# EAGLE design irs-qtouch (EAGLE 7.6.0)
CNAME: IRS sensor (RFM69HW); CREVISION: 1; DESIGNER: Dariusz Mazur

## Sheet 1 of 2
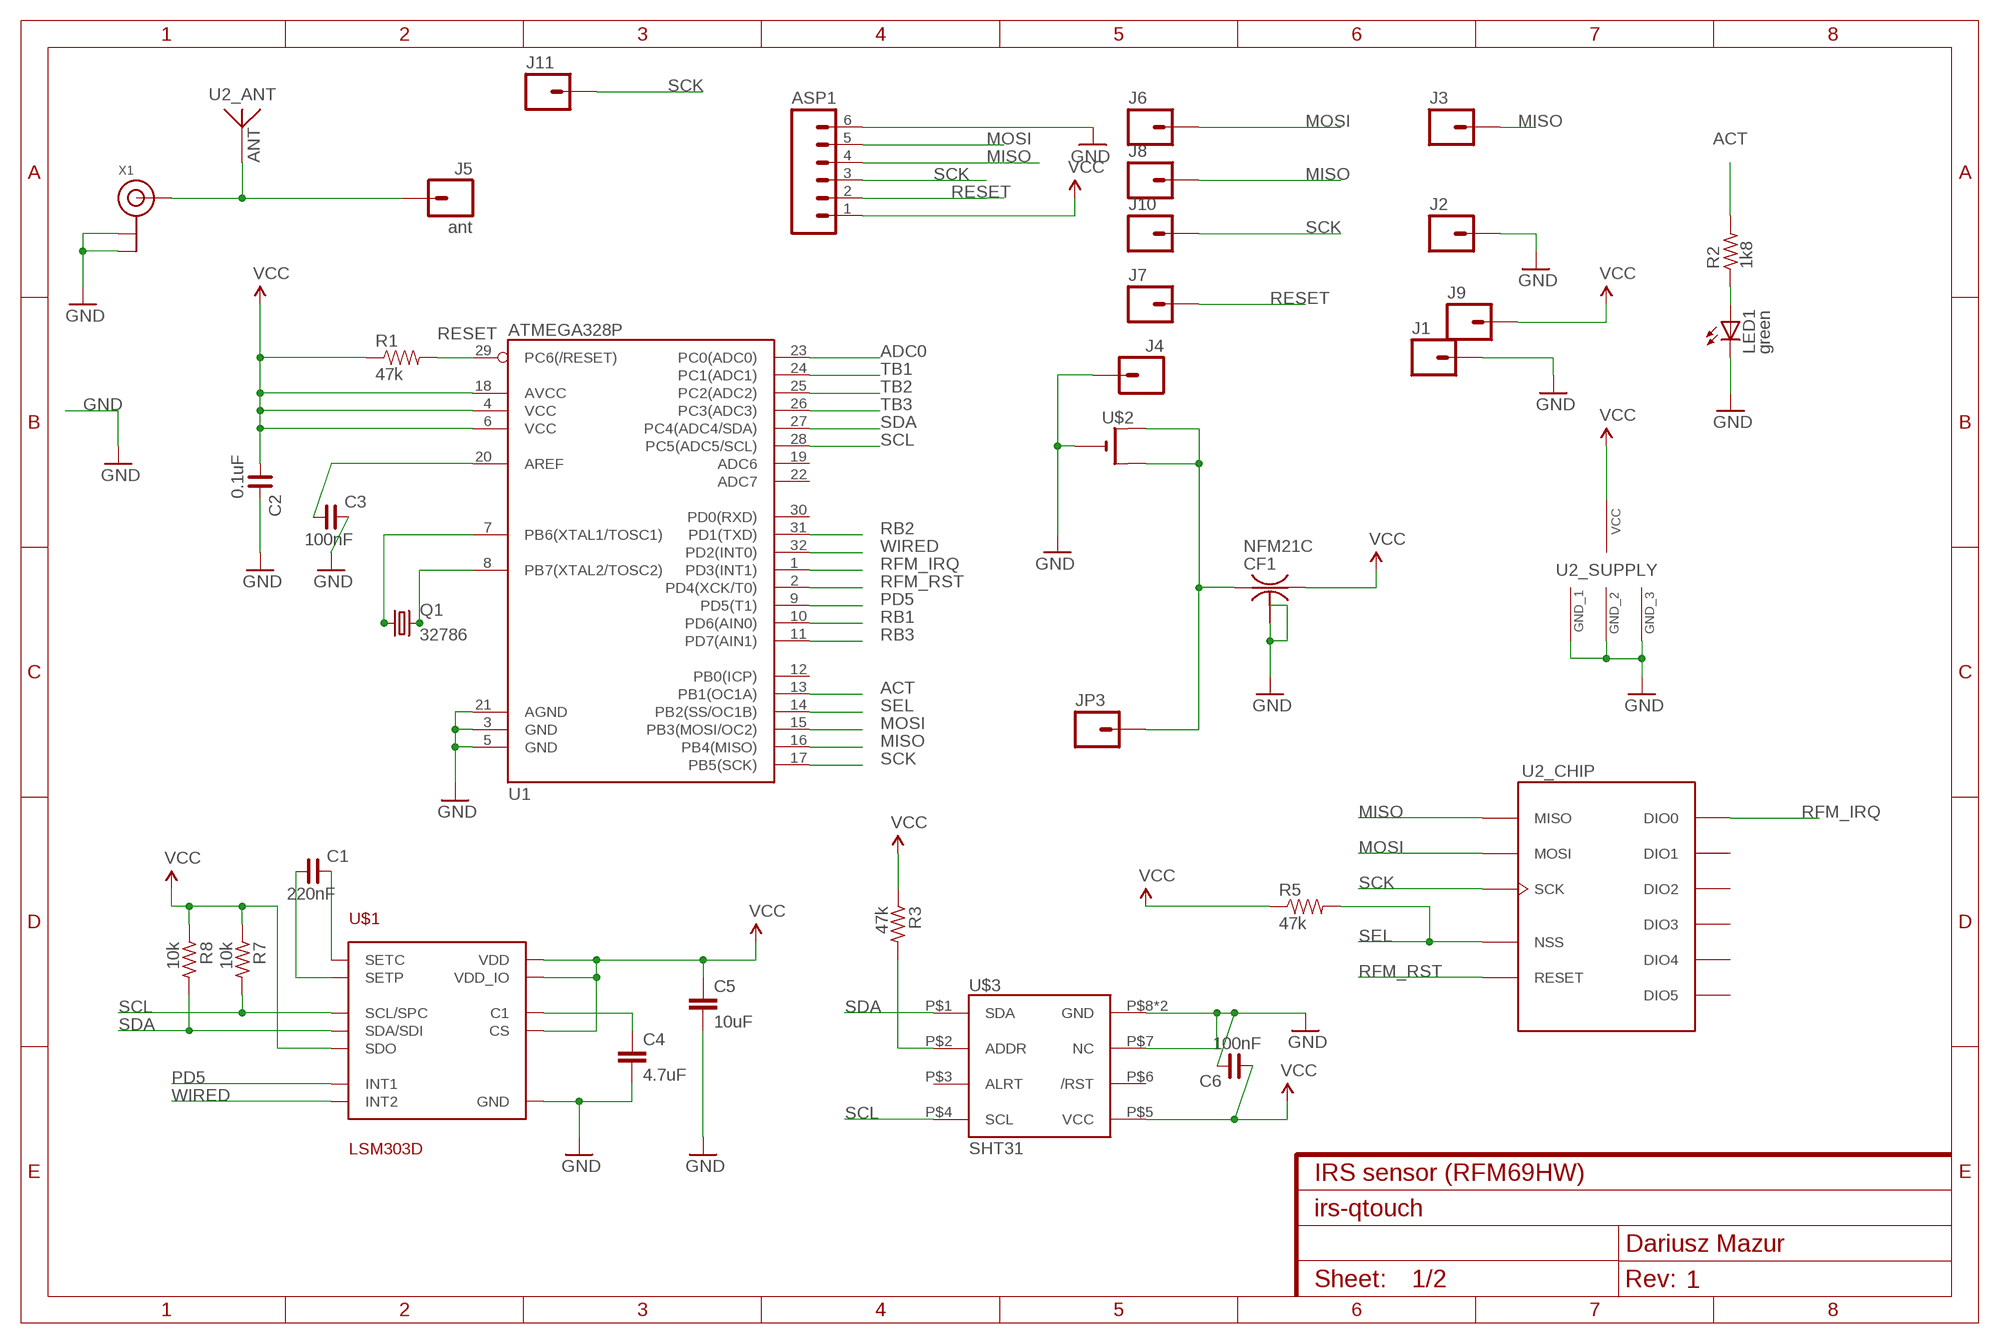
[diagram p0: schematic, sheet 1]

### Parts
ASP1  M06NO_SILK_YES_STOP  [1X06_NO_SILK_YES_STOP]
C1  220nF  C_0603  [C0603]
C2  0.1uF  C_0603  [C0603]
C3  100nF  C_0603  [C0603]
C4  4.7uF  C-EUC0603K  [C0603K]
C5  10uF  10UF10V10%(0805)  [0805-CAP]
C6  100nF  C_0603  [C0603]
CF1  NFM21C  [NFM21C]
J1  M01SMD-4.5X1.5  [PAD-1.5X4.5]
J2  M01PTH_NO_SILK_YES_STOP  [1X01_NO_SILK]
J3  M01PTH_NO_SILK_YES_STOP  [1X01_NO_SILK]
J4  M01SNAP-FEMALE  [SNAP-FEMALE]
J5  ant  M01PTH_NO_SILK_YES_STOP  [1X01_NO_SILK]
J6  M01SMD-4.5X1.5  [PAD-1.5X4.5]
J7  M01SMD-4.5X1.5  [PAD-1.5X4.5]
J8  M01SMD-4.5X1.5  [PAD-1.5X4.5]
J9  M01SMD-4.5X1.5  [PAD-1.5X4.5]
J10  M01SMD-4.5X1.5  [PAD-1.5X4.5]
J11  M01PTH_NO_SILK_YES_STOP  [1X01_NO_SILK]
JP3  M01SMDNS  [1X01NS]
LED1  green  LED0603  [LED-0603]
Q1  32786  MC-306  [MC-306]
R1  47k  RESISTOR0603-RES  [0603-RES]
R2  1k8  R_0603  [R0603]
R3  47k  R_0603  [R0603]
R5  47k  RESISTOR0603-RES  [0603-RES]
R7  10k  R_0603  [R0603]
R8  10k  R_0603  [R0603]
U1  ATMEGA328P  ATMEGA328_SMT  [TQFP32-08]
U2  RFM69HCW-S2  [HOPE-RF-16]
U$1  LSM303D  [LGA16-3MM]
U$2  CR2032THM  [CR2032-THRU]
U$3  SHT31  SHT31-DIS  [SHT3X]
X1  ANTENNA_U.FL  [U.FL]

### Nets
ACT: R2.2 U1.13(PB1(OC1A))
ADC0: U1.23(PC0(ADC0))
GND: ASP1.6 C2.2 C3.2 C4.2 C5.2 C6.2 CF1.2@1 CF1.2@2 J1.P$1 J2.1 J4.1 LED1.C U1.3(GND) U1.5(GND) U1.21(AGND) U2.GND1(_SUPPLY:GND_1) U2.GND2(_SUPPLY:GND_2) U2.GND3(_SUPPLY:GND_3) U$1.5(GND) U$1.10(GND) U$1.12(GND) U$1.13(GND) U$1.16(GND) U$2.- U$3.P$7(NC) U$3.P$8(GND) U$3.PAD(GND) X1.1(GND) X1.2(GND)
MISO: ASP1.4 J3.1 J8.P$1 U1.16(PB4(MISO)) U2.MISO(_CHIP:MISO)
MOSI: ASP1.5 J6.P$1 U1.15(PB3(MOSI/OC2)) U2.MOSI(_CHIP:MOSI)
N$1: LED1.A R2.1
N$2: CF1.1 JP3.1 U$2.+1(+) U$2.+2(+1)
N$3: J5.1 U2.ANT(_ANT:ANT) X1.3(SIGNAL)
N$4: C3.1 U1.20(AREF)
N$5: Q1.1 U1.7(PB6(XTAL1/TOSC1))
N$6: Q1.4 U1.8(PB7(XTAL2/TOSC2))
N$12: C1.1 U$1.3(SETP)
N$13: C1.2 U$1.2(SETC)
N$14: C4.1 U$1.15(C1)
N$15: R3.2 U$3.P$2(ADDR)
PD5: U1.9(PD5(T1)) U$1.11(INT1)
RB1: U1.10(PD6(AIN0)) ; also sheet 2
RB2: U1.31(PD1(TXD)) ; also sheet 2
RB3: U1.11(PD7(AIN1)) ; also sheet 2
RESET: ASP1.2 J7.P$1 R1.2 U1.29(PC6(/RESET))
RFM_IRQ: U1.1(PD3(INT1)) U2.DIO0(_CHIP:DIO0)
RFM_RST: U1.2(PD4(XCK/T0)) U2.RESET(_CHIP:RESET)
SCK: ASP1.3 J10.P$1 J11.1 U1.17(PB5(SCK)) U2.SCK(_CHIP:SCK)
SCL: R7.2 U1.28(PC5(ADC5/SCL)) U$1.4(SCL/SPC) U$3.P$4(SCL)
SDA: R8.2 U1.27(PC4(ADC4/SDA)) U$1.6(SDA/SDI) U$3.P$1(SDA)
SEL: R5.2 U1.14(PB2(SS/OC1B)) U2.NSS(_CHIP:NSS)
TB1: U1.24(PC1(ADC1)) ; also sheet 2
TB2: U1.25(PC2(ADC2)) ; also sheet 2
TB3: U1.26(PC3(ADC3)) ; also sheet 2
VCC: ASP1.1 C2.1 C5.1 C6.1 CF1.3 J9.P$1 R1.1 R3.1 R5.1 R7.1 R8.1 U1.4(VCC) U1.6(VCC) U1.18(AVCC) U2.3.3V(_SUPPLY:VCC) U$1.1(VDD_IO) U$1.7(SDO) U$1.8(CS) U$1.14(VDD) U$3.P$5(VCC)
WIRED: U1.32(PD2(INT0)) U$1.9(INT2)
Unconnected: U1.12(PB0(ICP)) U1.19(ADC6) U1.22(ADC7) U1.30(PD0(RXD)) U2.DIO1(_CHIP:DIO1) U2.DIO2(_CHIP:DIO2) U2.DIO3(_CHIP:DIO3) U2.DIO4(_CHIP:DIO4) U2.DIO5(_CHIP:DIO5) U$3.P$3(ALRT) U$3.P$6(/RST)

## Sheet 2 of 2
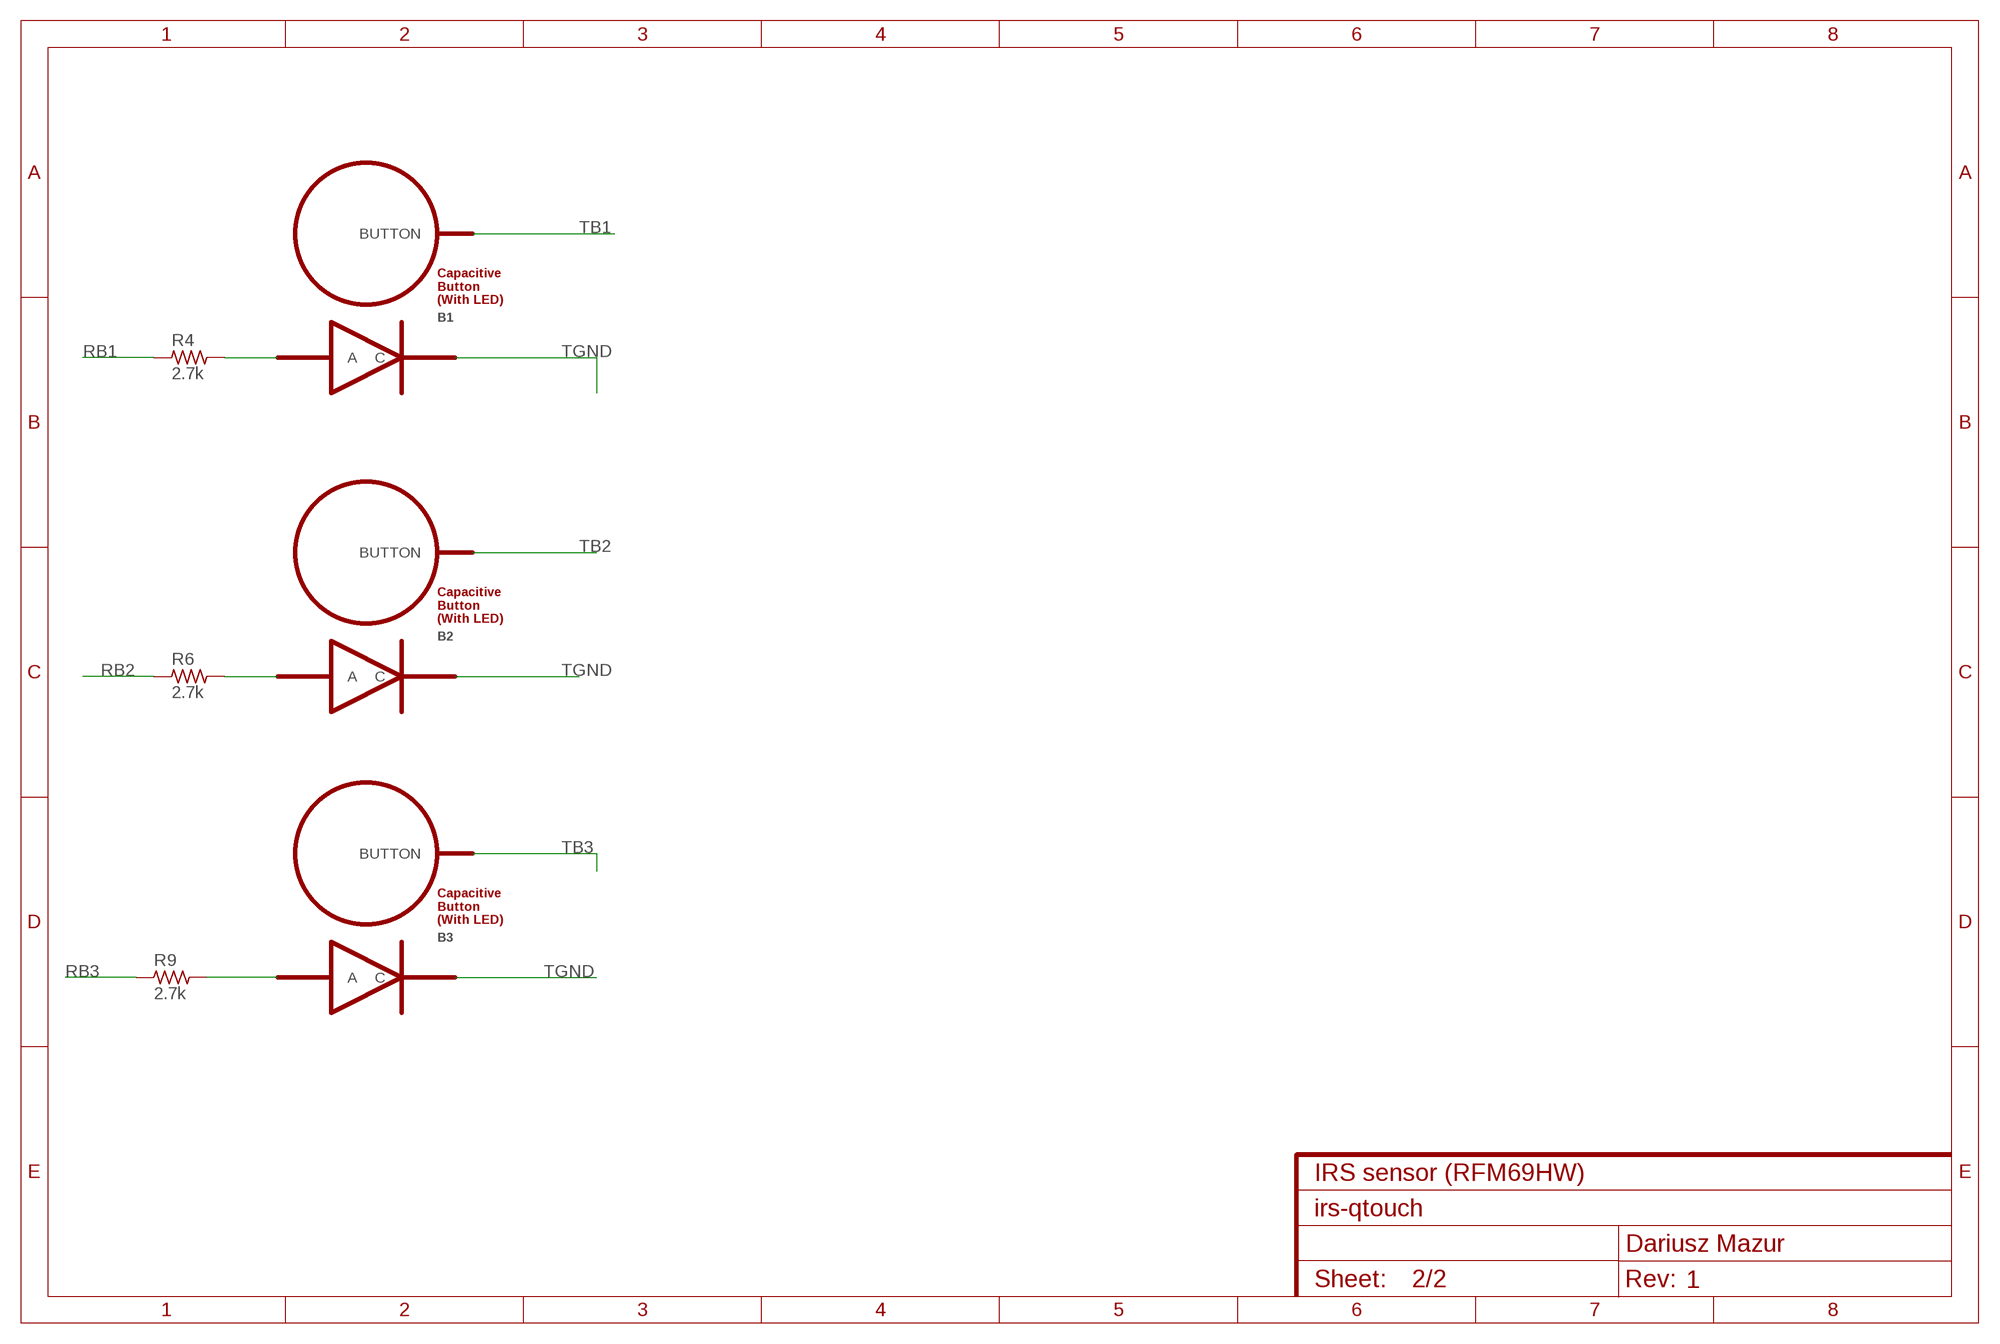
[diagram p1: schematic, sheet 2]

### Parts
B1  BUTTON_PASSIVE_LED  [BUTTON_PASSIVE_12MM_LED]
B2  BUTTON_PASSIVE_LED  [BUTTON_PASSIVE_12MM_LED]
B3  BUTTON_PASSIVE_LED  [BUTTON_PASSIVE_12MM_LED]
R4  2.7k  R_0603  [R0603]
R6  2.7k  R_0603  [R0603]
R9  2.7k  R_0603  [R0603]

### Nets
N$11: B2.A R6.2
N$19: B1.A R4.2
N$20: B3.A R9.2
RB1: R4.1 ; also sheet 1
RB2: R6.1 ; also sheet 1
RB3: R9.1 ; also sheet 1
TB1: B1.BUTTON ; also sheet 1
TB2: B2.BUTTON ; also sheet 1
TB3: B3.BUTTON ; also sheet 1
TGND: B1.C B3.C
Unconnected: B2.C

## Library data of the parts
ASP1 = SparkFun-Connectors:M06: Header 6 Standard 6-pin 0.1" header. Use with straight break away headers (SKU : PRT-00116), right angle break away headers (PRT-00553), swiss pins (PRT-00743), machine pins (PRT-00117), and female headers (PRT-00115). Molex polarized connector foot print use with SKU : PRT-08094 with associated crimp pins and housings. NOTES ON THE VARIANTS LOCK and LOCK_LONGPADS... This footprint was designed to help hold the alignment of a through-hole component (i.e. 6-pin header) while soldering it into place. You may notice that each hole has been shifted either up or down by 0.005 of an inch from it's more standard position (which is a perfectly straight line). This slight alteration caused the pins (the squares in the middle) to touch the edges of the holes. Because they are alternating, it causes a "brace" to hold the component in place. 0.005 has proven to be the perfect amount of "off-center" position when using our standard breakaway headers. Although looks a little odd when you look at the bare footprint, once you have a header in there, the alteration is very hard to notice. Also,if you push a header all the way into place, it is covered up entirely on the bottom side. This idea of altering the position of holes to aid alignment will be further integrated into the Sparkfun Library for other footprints. It can help hold any component with 3 or more connection pins.
B1-B3 = PatternAgents-TouchWidgets:BUTTON_PASSIVE_LED: Button, Passive Touch/Capacitive Sensing Type, with LED & Hole Source : http://www.PatternAgents.com Github : https://github.com/PatternAgents License : http://creativecommons.org/licenses/by-sa/3.1/ (Creative Commons 3.1) THIS SOFTWARE IS PROVIDED BY THE CONTRIBUTORS "AS IS" AND WITHOUT ANY EXPRESS OR IMPLIED WARRANTIES, INCLUDING, BUT NOT LIMITED TO, THE IMPLIED WARRANTIES OF MERCHANTABILITY AND FITNESS FOR A PARTICULAR PURPOSE ARE DISCLAIMED. IN NO EVENT SHALL THE COPYRIGHT OWNER OR CONTRIBUTORS BE LIABLE FOR ANY DIRECT, INDIRECT, INCIDENTAL, SPECIAL, EXEMPLARY, OR CONSEQUENTIAL DAMAGES (INCLUDING, BUT NOT LIMITED TO, PROCUREMENT OF SUBSTITUTE GOODS OR SERVICES; LOSS OF USE, DATA, OR PROFITS; OR BUSINESS INTERRUPTION) HOWEVER CAUSED AND ON ANY THEORY OF LIABILITY, WHETHER IN CONTRACT, STRICT LIABILITY, OR TORT (INCLUDING NEGLIGENCE OR OTHERWISE) ARISING IN ANY WAY OUT OF THE USE OF THIS SOFTWARE, EVEN IF ADVISED OF THE POSSIBILITY OF SUCH DAMAGE.
C1-C3 C6 = rc-master-smd:C_: NON-POLARIZED CAP
C4 = resistor:C-EU: CAPACITOR, European symbol
C5 = SparkFun-Capacitors:10UF10V10%(0805): CAP-11330; PROD_ID: CAP-11330
CF1 = murata-filter:NFM: EMIFIL(R) (Capacitor type) Single Circuit Type for Signal Lines Source: http://search.murata.co.jp/Ceramy/image/img/PDF/ENG/L0111S0109NFM3DC.pdf; MPN: NFM21CC102R1H3D; OC_FARNELL: 1828795; OC_NEWARK: 84R0165
J1-J11 JP3 = SparkFun-Connectors:M01: Header 1 Standard 1-pin 0.1" header. Use with straight break away headers (SKU : PRT-00116), right angle break away headers (PRT-00553), swiss pins (PRT-00743), machine pins (PRT-00117), and female headers (PRT-00115). SMTSO-256-ET is a "flush mount" nut for a 4-40 screw. The older package used to be too tight, and did not allow it to sit properly thru the drill hit. The latest (0.165DIA) fits nice and snug.
LED1 = SparkFun-LED:LED: LEDs Standard schematic elements and footprints for 5mm, 3mm, 1206, and 0603 sized LEDs. 5mm - Spark Fun Electronics SKU : COM-00529 (and others)
Q1 = crystal:MC-306: kHz RANGE CRYSTAL UNIT SMD Source: MC-306_405_406_E07X.PDF Homepage <http://www.epsontoyocom.co.jp>; MPN: MC-306 60.0KHZ 100PPM ,12.5PF; OC_FARNELL: 1278040; OC_NEWARK: 31M5576
R1 R5 = SparkFun-Passives:RESISTOR: Resistor Basic schematic elements and footprints for 0603, 1206, and PTH resistors.
R2-R4 R6-R9 = rc-master-smd:R_: RESISTOR
U1 = SparkFun-DigitalIC:ATMEGA328_SMT: 32-Pin Atmega328 part Commonly used on Arduino compatible boards Available in QFP and QFN packages TQFP is IC-09069 QFN is non-stock; PROD_ID: IC-09069
U2 = icmi-custom-parts:RFM69HCW: HopeRF RFM69HCW ISM Transceiver Module The RFM69HCW <http://www.hoperf.com/rf/fsk_module/RFM69HCW.htm> is a transceiver module capable of operation over a wide frequency range, including the 315,433,868 and 915MHz license-free ISM (Industry Scientific and Medical) frequency bands. All major RF communication parameters are programmable and most of them can be dynamically set. The RFM69HCW offers the unique advantage of programmable narrow-band and wide- band communication modes. The RFM69HCW is optimized for low power consumption while offering high RF output power and channelized operation. Compliance ETSI and FCC regulations. In order to better use RFM69HCW modules, this specification also involves a large number of the parameters and functions of its core chip RF69H's,including those IC pins which are not leaded out. All of these can help customers gain a better understanding of the performance of RFM69HCW modules, and enhance the application skills.
U$1 = pimoroni-ics:LSM303D
U$2 = adafruit:CR2032
U$3 = thomasb9511:SHT31-DIS
X1 = adafruit:ANTENNA_U.FL: U.FL Antenna Connector

## Board
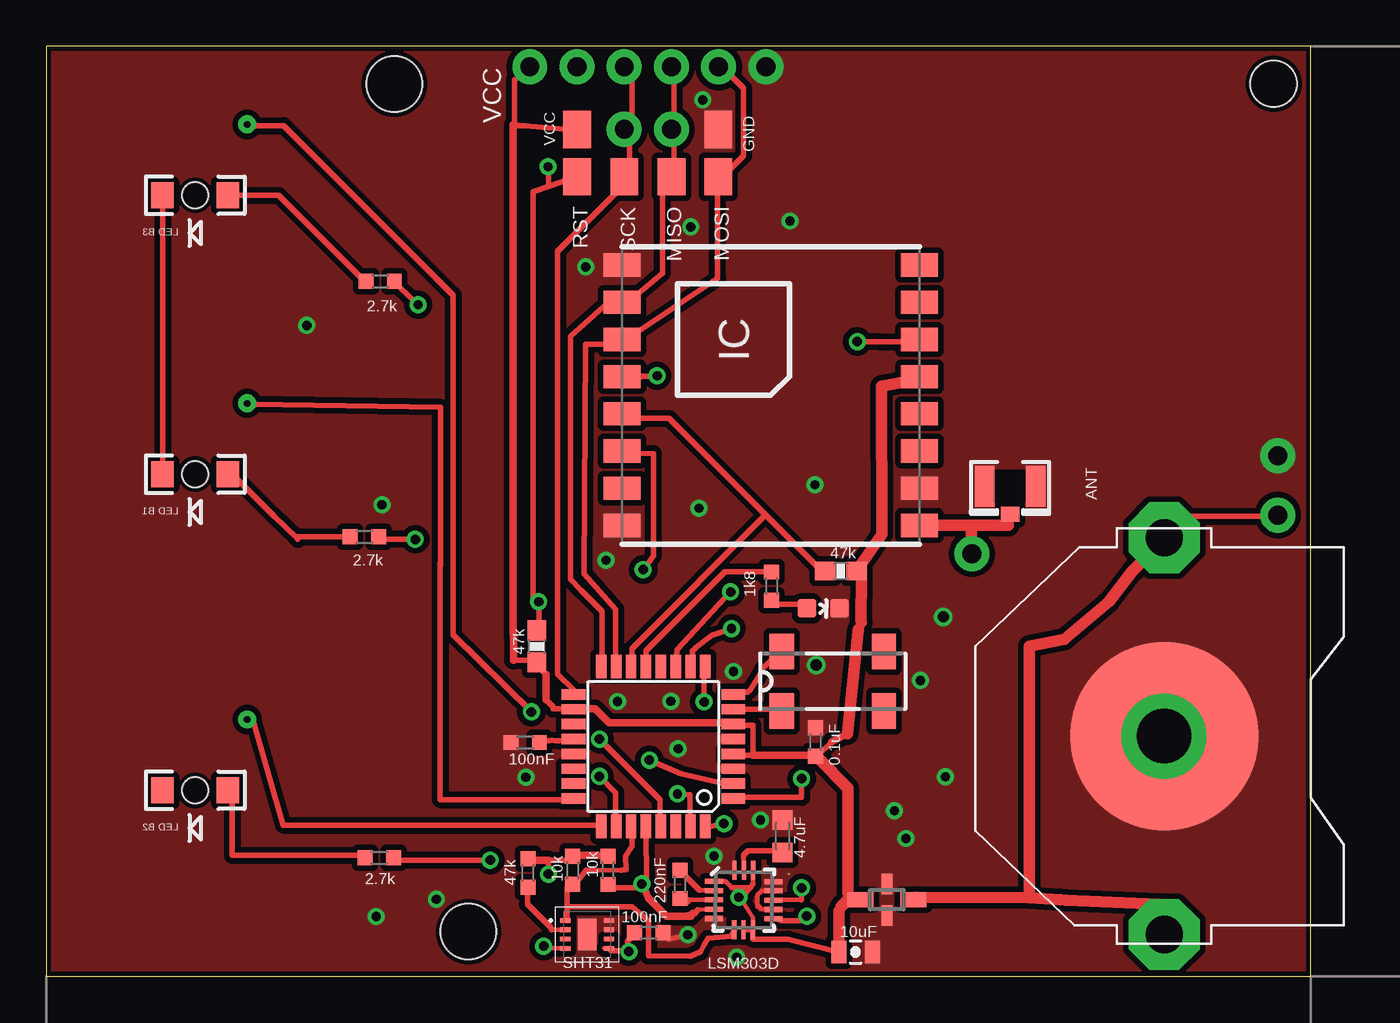
[diagram p2: board, top side]
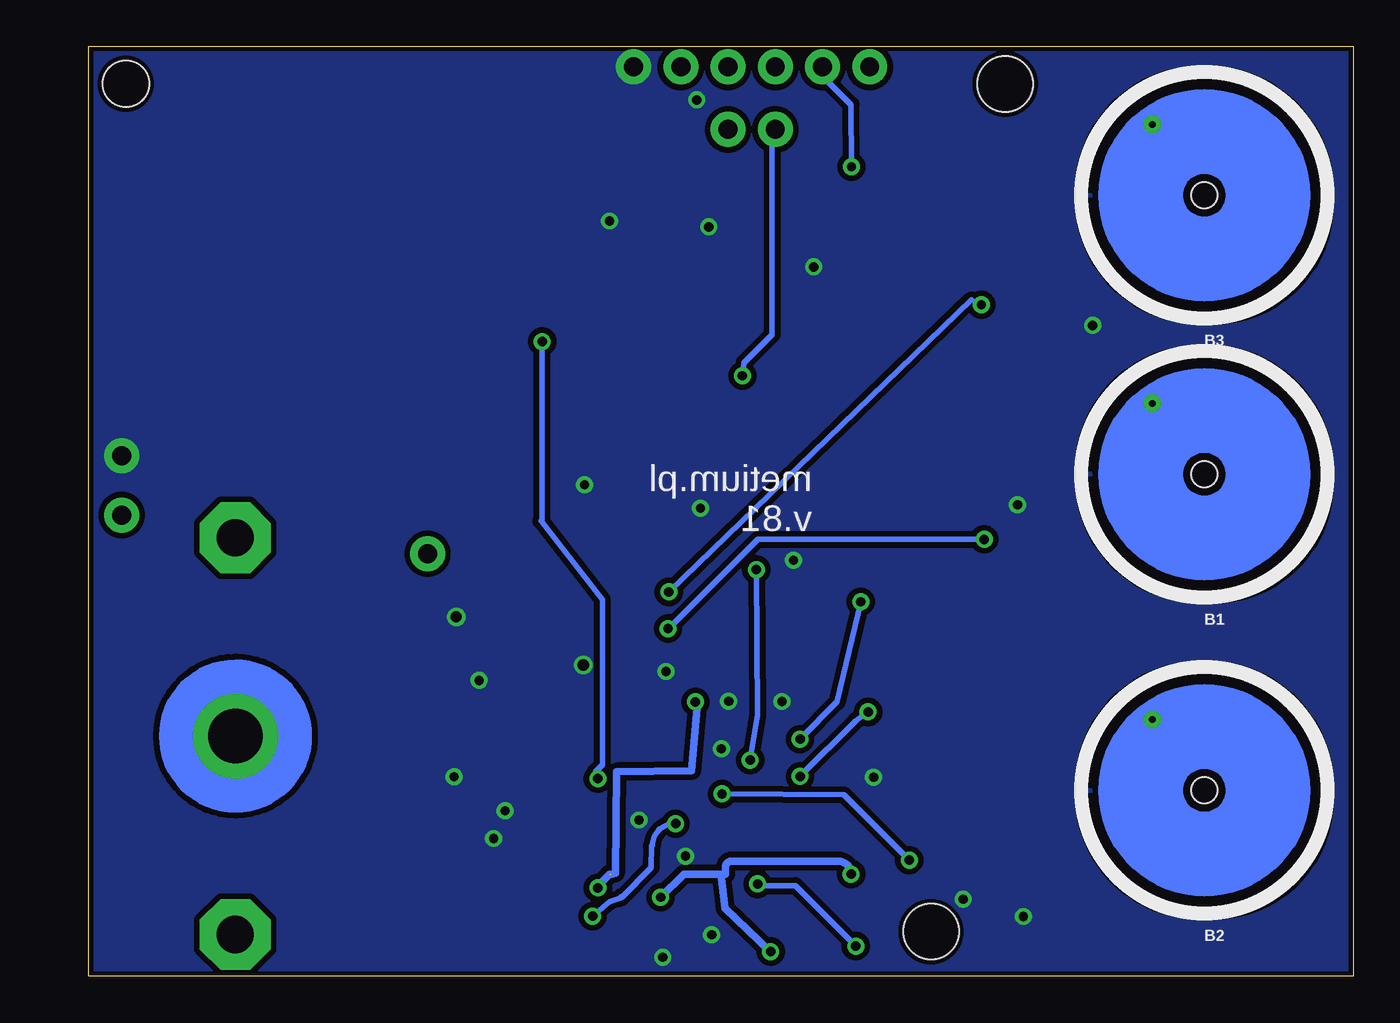
[diagram p3: board, bottom side, seen from below]

Size 68 x 50 mm. Coordinates in mm from the lower left corner, seen from the top.
Outline: 0,0 68,0 68,50 0,50 0,0
Copper layers (1*16): Top 0.035mm / dielectric 1.5mm / Bottom 0.035mm
Design rules "dirt_cheap_dirty_boards.v1 *": minimum track width 12mil, minimum drill 20mil, track to track 12mil, track to pad 10mil, pad to pad 10mil, via to via 12mil, smd to smd 0mil, copper to edge 10mil, drill to drill 12mil, minimum pad ring 12mil, minimum via ring 8mil, stop-mask expansion 2mil, vias tented up to drill 25mil, thermal gap 10mil
Holes 2.5 mm at 66.01,47.99
Holes 3 mm at 22.7,2.4 18.71,47.98

### Footprints (pad centres in the part's own frame; a part is rotated, then mirrored left to right if it is on the bottom)
1X06_NO_SILK_YES_STOP = drill 1.016 pad 1.88: 1 0,0; 2 2.54,0; 3 5.08,0; 4 7.62,0; 5 10.16,0; 6 12.7,0
BUTTON_PASSIVE_12MM_LED = smd 1.2 x 1.4 bottom: A -1.754,0; C 1.754,0 | drill 0.356: BUTTON -2.794,3.81 | hole 1.4: 0,0
C0603 = smd 0.8 x 0.8: 1 -0.762,0; 2 0.762,0
C0603K = smd 1.05 x 1.08: 1 -0.875,0; 2 0.875,0
0805-CAP = smd 0.8 x 1.2: 1 -0.9,0; 2 0.9,0
NFM21C = smd 1.4 x 0.8: 1 -1.425,0; 3 1.425,0 | smd 0.6 x 1.1: 2@1 0,-0.85; 2@2 0,0.85
PAD-1.5X4.5 = smd 1.5 x 2: P$1 0,0
1X01_NO_SILK = drill 1.016 pad 1.88: 1 0,0
SNAP-FEMALE = drill 2.921 pad 4.572: 1 0,0
1X01NS = drill 1.016 pad 1.88: 1 0,0
LED-0603 = smd 1 x 1: A 0,-0.877; C 0,0.877
MC-306 = smd 1.3 x 1.9: 1 -2.75,-1.6; 2 2.75,-1.6; 3 2.75,1.6; 4 -2.75,1.6
0603-RES = smd 1.1 x 1: 1 -0.85,0; 2 0.85,0
R0603 = smd 0.8 x 0.8: 1 -0.762,0; 2 0.762,0
TQFP32-08 = smd 1.27 x 0.559: 1 -4.293,2.8; 2 -4.293,2; 3 -4.293,1.2; 4 -4.293,0.4; 5 -4.293,-0.4; 6 -4.293,-1.2; 7 -4.293,-2; 8 -4.293,-2.8; 17 4.293,-2.8; 18 4.293,-2; 19 4.293,-1.2; 20 4.293,-0.4; 21 4.293,0.4; 22 4.293,1.2; 23 4.293,2; 24 4.293,2.8 | smd 0.559 x 1.27: 9 -2.8,-4.293; 10 -2,-4.293; 11 -1.2,-4.293; 12 -0.4,-4.293; 13 0.4,-4.293; 14 1.2,-4.293; 15 2,-4.293; 16 2.8,-4.293; 25 2.8,4.293; 26 2,4.293; 27 1.2,4.293; 28 0.4,4.293; 29 -0.4,4.293; 30 -1.2,4.293; 31 -2,4.293; 32 -2.8,4.293
HOPE-RF-16 = smd 1.25 x 2: 3.3V 1,-8; ANT -7,-8; DIO0 3,-8; DIO1 5,-8; DIO2 7,-8; DIO3 -3,-8; DIO4 -1,-8; DIO5 -5,8; GND1 7,8; GND2 -7,8; GND3 -5,-8; MISO 5,8; MOSI 3,8; NSS -1,8; RESET -3,8; SCK 1,8
LGA16-3MM = smd 1 x 0.25: 1 -1.6,1; 2 -1.6,0.5; 3 -1.6,0; 4 -1.6,-0.5; 5 -1.6,-1; 9 1.6,-1; 10 1.6,-0.5; 11 1.6,0; 12 1.6,0.5; 13 1.6,1 | smd 0.25 x 1: 6 -0.5,-1.6; 7 0,-1.6; 8 0.5,-1.6; 14 0.5,1.6; 15 0,1.6; 16 -0.5,1.6
CR2032-THRU = drill 2 pad 3.81 octagon: +1 -10.668,0; +2 10.668,0 | smd 10.16 x 10.16: - 0,0
SHT3X = smd 0.55 x 0.25: P$1 -1.175,0.75; P$2 -1.175,0.25; P$3 -1.175,-0.25; P$4 -1.175,-0.75; P$5 1.175,-0.75; P$6 1.175,-0.25; P$7 1.175,0.25; P$8 1.175,0.75 | smd 1 x 1.7: PAD 0,0
U.FL = smd 2.2 x 1.05: 1 0,1.375; 2 0,-1.375 | smd 0.8 x 1: 3 1.525,0

### Placement (x,y rotation side)
ASP1  26,48.9 180 bottom
B1  8,27 0 bottom
B2  8,10 0 bottom
B3  8,42 0 bottom
C1  34.08,4.94 90 top
C2  41.37,12.6 90 top
C3  25.75,12.57 180 top
C4  39.6,7.54 90 top
C5  43.53,1.3 0 top
C6  32.4,2.34 0 top
CF1  45.21,4.12 180 top
J1  36.14,45.54 0 top
J2  66.24,28 90 top
J3  33.62,45.54 0 top
J4  60.12,12.92 0 bottom
J5  49.78,22.72 0 top
J6  36.14,43 180 top
J7  28.54,43 180 top
J8  33.62,43 180 top
J9  28.54,45.54 0 top
J10  31.08,43 180 top
J11  31.08,45.54 0 top
JP3  66.24,24.8 90 top
LED1  41.78,19.78 270 top
Q1  42.3,15.87 0 top
R1  26.39,17.74 90 top
R2  39.01,20.98 90 top
R3  25.9,5.55 270 top
R4  17.1,23.63 180 top
R5  42.74,21.79 180 top
R6  17.9,6.37 180 top
R7  30.21,5.7 270 top
R8  28.31,5.7 270 top
R9  17.95,37.37 180 top
U1  32.65,12.36 180 top
U2  38.96,31.24 90 top
U$1  37.51,4.1 359.7 top
U$2  60.13,12.91 270 top
U$3  29.09,2.25 0 top
X1  51.84,26.36 270 top

### Tracks (layer width: path | path; a pad name or v marks a point on that pad's centre or on a via)
ACT
  Top 0.305: R2.2 36.5,21.75 32.25,17.5 32.25,16.75 U1.13
ADC0
  Top 0.305: 28.2,10.37 U1.23
GND  (via drill 0.5, 0.5 pad 0.25, 0.51, 0.6 pad 0.25)
  Top 0.254: U$1.12 38.47,4.59 38.47,4.58 38.45,4.58 38.25,4.37 38.25,3.84 | 38.25,3.84 38.49,3.59 U$1.10 39,3.62 | 38.25,3.75 38.25,3.84
  Top 0.305: U1.21 | 33.5,2 v34.5,2.23
  other vias: 17.74,3.22 20.97,4.14 47.02,15.91 48.24,19.33 33.59,14.79 30.71,14.78 48.36,10.73 46.24,7.41 35.91,6.46 41.34,26.43 37.13,1.03 36.95,16.39 38.41,8.4 45.62,8.9 14,35 18.05,25.36 41.4,16.74 25.79,10.7 33.98,12.24 35.3,47.13 29.01,38.15 35.1,25.16 30.1,22.37 34.66,40.3 40,40.61
  pour Bottom (no thermals): 0,50 68,50 68,0 0.1,0
  pour Top (no thermals): 0,0 68,0 68,50 0,50
MISO
  Top 0.305: 29.88,16.75 U1.16 29.88,16.88 29.88,19.62 28.75,20.75 28.18,21.36 28.19,34.42 30.5,36.5 U2.MISO | 34,43 33.75,43 | 30.62,36.12 30.88,36.12 U2.MISO | 33.75,43 33.75,45.5 J3.1 33.75,45.75 33.75,48.75 ASP1.4 | 33.75,43 J8.P$1 33.5,43 33.13,42.31 33.13,37.81 31,36 U2.MISO
MOSI
  Top 0.305: ASP1.5 36.5,48.75 37.5,47.75 37.5,44.12 36.38,43 J6.P$1 36.12,42.88 36.1,41.29 36.1,37.54 31.38,34.38 31,34.38 U2.MOSI | 30.62,34.12 30.88,34.12 U2.MOSI | U1.15 30.62,16.75 30.62,19.75 28.92,21.65 28.99,34 30.5,34 U2.MOSI | 30.5,34.12 U2.MOSI
N$1
  Top 0.305: R2.1 39.25,20 40.75,20 LED1.A
N$2
  Top 0.254: 60,4 60,2.5 U$2.+2 | 60,23.5 U$2.+1
  Top 0.305: 46.75,4.25 CF1.1 | 59.88,3.88 U$2.+2 | 54.83,4.08 54.53,4.11 | 60,23.38 U$2.+1 60.25,23.62 60.25,24.75 66.12,24.75 JP3.1
  Top 0.61: 54.53,4.11 52.87,4.24 | 52.87,4.24 52.87,17.75 54.75,18.12 57.14,20.15 58.38,21.75 60,23.38 | 52.87,4.24 46.75,4.25 | 54.83,4.08 59.88,3.88
N$3
  Top 0.305: 47,24.25 U2.ANT 47.12,24.25 | 49.75,22.75 J5.1 | 51.75,24.25 51.75,24.75 X1.3
  Top 0.61: 49.75,24.25 47.12,24.25 | 49.75,22.75 49.75,24.25 | 51.75,24.25 49.75,24.25
N$4
  Top 0.305: U1.20 27.56,12.65 arc27 C3.1
N$5
  Top 0.305: U1.7 39.29,14.36 Q1.1
N$6
  Top 0.305: U1.8 36.95,15.27 37.7,15.27 37.86,15.4 38.49,16.41 38.5,16.5 39.5,17.5 Q1.4
N$11
  Top 0.305: 17.12,6.38 17,6.38 17,6.5 R6.2 16.88,6.5 10,6.5 10,9.88 B2.A 10,10
N$12
  Top 0.254: 34.5,4.12 35.88,4.12 U$1.3
  Top 0.305: C1.1 34,4 34.5,4 34.5,4.12
N$13
  Top 0.254: 35.12,4.62 35.88,4.62 U$1.2
  Top 0.305: 35.12,4.62 34.12,5.62 34.12,5.75 C1.2
N$14
  Top 0.254: 37.5,6.38 37.5,5.75 U$1.15
  Top 0.305: 37.5,6.38 37.5,6.5 37.75,6.75 38.5,6.75 38.55,6.74 39.55,6.74 C4.1
N$15
  Top 0.254: 27.18,2.5 U$3.P$2
  Top 0.305: 26,4.88 R3.2 25.88,4.75 25.88,3.88 27.12,2.62 27.18,2.5
N$19
  Top 0.305: 13.45,23.57 12.25,24.75 10,27 B1.A | 13.45,23.57 13.52,23.5 | R4.2 16.25,23.62 13.5,23.62 13.45,23.57
N$20
  Top 0.305: 10,42 B3.A 12.5,42 17.12,37.38 R9.2
PD5  (via drill 0.51)  (1 unrouted)
  Top 0.254: 40.62,4.12 39.12,4.12 U$1.11
  Top 0.305: v40.62,4.75 40.62,4.12 | 35.25,14.71 v35.38,14.75 35.38,16.5 U1.9 35.5,16.62
  Bottom 0.254: 40.75,4.88 40.62,4.88 v40.62,4.75
  Bottom 0.305: v35.38,14.75 35.25,14.71
  Bottom 0.406: 35.25,14.71 35.58,11.06 39.62,11 39.68,5.54 39.88,5.5 | 40,5.5 40.62,4.88
RB1  (via drill 0.51)
  Top 0.305: v36.85,18.7 35.8,18.33 34.91,17.67 34.88,17.62 34.75,17.5 34.75,16.75 U1.10 | 17.88,23.62 R4.1 18,23.5 v19.84,23.5
  Bottom 0.305: v19.84,23.5 32,23.5 36.5,19 v36.85,18.7
RB2  (via drill 0.51)
  Top 0.305: v33.95,9.8 34.62,9.75 34.62,8.25 | 34.62,8.12 34.62,8.25 | R6.1 18.75,6.25 23.75,6.25 v23.87,6.24 | U1.31 34.75,8.25 34.62,8.25
  Bottom 0.305: v23.87,6.24 27.38,9.75 v33.95,9.8
RB3  (via drill 0.51)
  Top 0.305: v36.8,20.67 33.93,17.57 33.88,16.75 U1.11 | v19.99,36.11 18.5,37.5 18.62,37.38 R9.1
  Bottom 0.305: v36.8,20.67 20.53,36.37 v19.99,36.11
RESET  (via drill 0.51)
  Top 0.305: 27.05,42.49 28.5,43 J7.P$1 | 27.05,42.49 26.18,42.19 26.18,20.19 26.5,20.15 | 26.5,20.15 26.5,19.95 26.5,18.83 R1.2 | v29.75,12.75 33,9.5 33,8.25 U1.29 | 26.5,20.15 26.5,20.12 v26.48,20.14 | v26.98,43.53 27,42.62 27.05,42.49
  Bottom 0.254: 28.75,48.75 ASP1.2
  Bottom 0.305: v29.75,12.75 27.75,14.75 v26.48,20.14 | v26.98,43.53 27,46.88 28.75,48.62 ASP1.2
RFM_IRQ  (via drill 0.51)
  Top 0.305: v40.62,10.62 40.62,9.62 37,9.62 U1.1 | 47,34 47,34.12 U2.DIO0 46.88,34.12 44.75,34.12 v43.62,34.13
  Bottom 0.305: v43.62,34.13 43.63,24.52 43.69,24.49 40.38,20.25 40.38,11.38 40.75,11 40.75,10.62 v40.62,10.62
RFM_RST  (via drill 0.51)
  Top 0.305: v32.43,11.62 34.14,10.88 36.46,10.37 36.5,10.38 36.88,10.38 U1.2 | 31,28.12 U2.RESET 31.12,28.12 32.64,28.11 32.65,22.62 32.2,21.98 v32.1,21.87
  Bottom 0.305: v32.43,11.62 32.04,14.03 v32.1,21.87
SCK  (via drill 0.51)
  Top 0.305: 31.12,42.88 J10.P$1 | 31.38,46.25 31.38,46 | 31.38,46 31.38,45.5 | 31.38,45.5 31.38,43.12 31.25,43 J10.P$1 | 31.38,46 31.5,46 31.5,48.5 ASP1.3 | 30.62,32.12 30.88,32.12 U2.SCK | 28.38,15.25 U1.17 28.38,15.38 27.5,16.25 27.5,39 31.12,42.62 J10.P$1 | 31.38,32.38 31,32.38 U2.SCK | 30.5,32.12 U2.SCK | 31.12,42.75 J10.P$1 | J11.1 31.5,45.5 31.38,45.5 | U2.SCK 31.98,32.26 32,32.25 31.83,32.28 32.58,32.28 v32.85,32.29
  Bottom 0.305: J11.1 31.12,45.5 31.25,45.5 31.25,34.5 32.75,33 v32.85,32.29
SCL  (via drill 0.51)
  Top 0.254: U$1.4 35.02,3.58 | 27,1.5 U$3.P$4
  Top 0.305: 32.12,4.75 32,4.75 | 32,4.75 30.12,4.75 30.12,4.88 R7.2 | U1.28 32.25,8.12 32.25,8 32.29,5 32.25,5 32.12,5 v32.03,4.97 32,4.88 32,4.75 | 35.02,3.58 35,3.5 34.88,3.38 34.75,3.38 | v26.75,1.62 26.88,1.5 27,1.5 | 34.75,3.38 34.75,3.37 | 34.75,3.38 34.66,3.23
  Top 0.406: 34.51,3.26 34.75,3.37 34.79,3.39 | 34.66,3.23 33.35,3.23 32.38,4.19 32.08,4.92 v32.03,4.97
  Bottom 0.305: v26.75,1.62 30,4.88 32,4.88 | 32.25,4.88 32,4.88 | v32.03,4.97 32,5 32,4.88
SDA
  Top 0.254: 28,3 U$3.P$1 | U$1.6 | 29.02,5.69 30.91,5.69
  Top 0.305: 28,3.75 28,4.75 28.12,4.75 R8.2 28.25,4.88 28.38,5 28.5,5 29.02,5.69 | 28,3.75 28,3 | U$1.6 36.84,2.16 35.58,2.04 35.39,1.73 35.19,1.32 34.64,1.07 32.38,1.1 32.37,2.98 31.5,3.75 28,3.75 | 30.91,5.69 31.18,5.72 31.16,6.45 31.5,7 31.5,8 U1.27
SEL
  Top 0.305: 38.69,24.81 33.5,30 31,30 U2.NSS | 38.69,24.81 41.5,22 R5.2 | 38.69,24.81 31.5,17.62 31.5,16.75 U1.14
TB1
  Top 0.305: U1.24 28.25,9.5 21.19,9.5 21.19,22.25 21.19,22.09 21.19,30.59 11,30.75 B1.BUTTON
TB2
  Top 0.305: 11.12,13.88 11.12,13.75 | 11.12,13.75 12.73,8.12 29.75,8.12 29.75,8 U1.25 | B2.BUTTON 11,13.75 11.12,13.75
TB3  (via drill 0.51)
  Top 0.305: 10.75,45.75 B3.BUTTON | 10.62,45.75 B3.BUTTON | v29.75,10.75 30.62,9.88 30.62,8.12 U1.26 | v26.09,14.22 21.88,18.38 21.88,36.62 12.75,45.75 10.88,45.75 B3.BUTTON
  Bottom 0.305: v29.75,10.75 26.75,13.75 v26.09,14.22
TGND
  Top 0.305: B1.C B3.C
VCC  (via drill 0.51)
  Top 0.254: 38,2.38 U$1.8 | U$1.14 38,5.7 38.01,4.99 37.83,4.71 37.37,4.17 38,3.15 38.01,3.14 U$1.8 | U$1.1 36.52,5.11 36.87,4.76 | 38,2 38,2.25 U$1.8 | 37.55,2.51 U$1.7 | 30,1.5 U$3.P$5
  Top 0.305: 36.87,4.76 37.25,4.76 | 37.25,4.76 37.88,4.76 | 37.88,4.76 37.73,4.75 | v37.25,4.25 37.25,4.76 | v27,5.5 27,6.25 27.88,6.25 R8.1 28.12,6.38 28.29,6.5 | R3.1 26,6.38 26,6.25 | 37.88,4.76 37.88,4.75 38.01,4.99 | U$1.8 37.55,2.51 | R7.1 30.12,6.5 30.04,6.5 | 38,2 39.88,2 C5.1 42.75,1.5 42.62,1.62 | U$3.P$5 30.38,1.38 31.25,1.38 v31.33,1.33 31.25,1.5 31.25,1.88 31.62,2.25 C6.1 | 25.11,45.78 25.74,45.73 | 25.74,45.73 28.5,45.5 J9.P$1 | 26,48.75 ASP1.1 26,48.62 25.18,48.2 25.18,45.7 25.74,45.73 | 42.75,3.75 42.62,3.5 | 43.25,4.25 CF1.3 43.12,4.5 | 46.62,32.06 46.88,32.12 U2.3.3V | 41.25,11.88 C2.1 | U1.4 37,11.88 38,11.88 38,13.5 37,13.5 U1.6 36.88,13.62 | 28.5,14.38 U1.18 28.25,14.38 27.25,14.38 27.25,14.5 26.88,14.88 | 43.62,21.88 R5.1 | 42.25,12.62 41.5,11.88 C2.1 | 43.62,21.75 R5.1 | 41.5,11.75 C2.1 | 25.12,17 26.38,17 R1.1 26.38,16.75 26.88,16.25 | 25.12,18.25 25.11,18.41 | 43.85,21.5 44,21.5 R5.1 | 43.82,19.11 44,19 43.5,18.5 43.65,18.48
  Top 0.406: 30.04,6.5 28.29,6.5 | 27,6.25 26,6.25 | 25.11,45.78 25.11,18.41 | 38,11.88 41.25,11.88 | 36.88,13.62 30.25,13.62 29.5,14.38 28.5,14.38 | 42.25,12.62 43.08,13.04 | 25.12,18.25 25.12,17 | 26.88,14.88 26.88,16.25
  Top 0.61: 42.62,1.62 42.62,3.5 | 43.25,4.25 42.75,3.75 | 46.62,32.06 44.9,31.73 44.94,23.78 43.62,21.88 | 43.82,19.11 43.85,21.5 43.85,21.52 | 43.08,13.04 43.65,18.48 43.67,18.66 | 41.5,11.75 43.12,10.12 43.12,4.5
  Bottom 0.305: 33.75,5.5 34,5.5
  Bottom 0.406: v37.25,4.25 36,5.5 34,5.5 33.78,3.65 v31.33,1.33 | v27,5.5 arc-90 27.69,6.19 33.44,6.19 arc-90 33.75,5.88 33.75,5.5
WIRED  (via drill 0.5, 0.51)
  Top 0.254: 39.5,3 U$1.9 | v40.91,3.23 40.91,3.29
  Top 0.305: 35.58,8.06 U1.32 35.5,8.12 | 35.5,8.5 35.5,8.12 | 35.5,8.12 35.5,8.01 v36.44,8.21 | 39.5,3 40.5,3 v40.91,3.23
  Bottom 0.254: 37.7,7.04 37.7,7.04 arc90 37.72,7.01 37.74,7.01 | v40.91,3.23
  Bottom 0.305: v36.44,8.21 arc-90 37.7,7.04 | 37.74,7.01 37.76,5.84 39.33,4.24 | 39.33,4.24 39.37,4.28 | v40.91,3.23 40,4 39.51,4.18 39.33,4.24

### Text on the board
tPlace: VCC | GND | RST | SCK | MISO | MOSI | ANT
bPlace: metium.pl / v.81
tNames: VCC